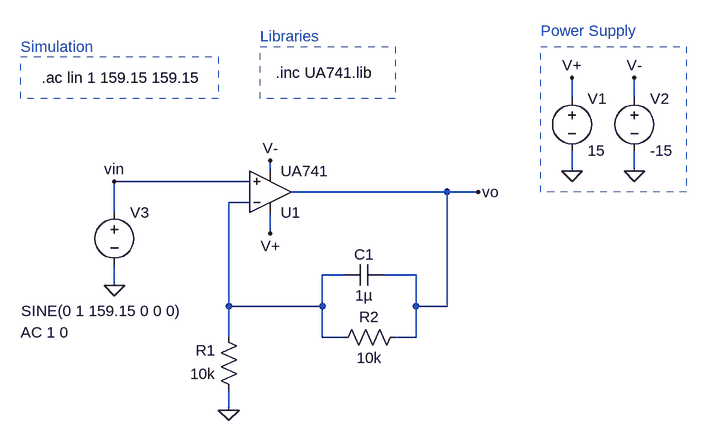
[diagram p0: schematic Example_2.asc]
Example_2.asc, the LTspice schematic file:
Version 4
SHEET 1 1788 680
WIRE 656 -272 656 -304
WIRE 752 -272 752 -304
WIRE 192 -160 192 -176
WIRE 656 -160 656 -192
WIRE 752 -160 752 -192
WIRE 160 -144 -48 -144
WIRE 464 -128 224 -128
WIRE 512 -128 464 -128
WIRE 160 -112 128 -112
WIRE -48 -96 -48 -144
WIRE 192 -64 192 -96
WIRE 304 0 272 0
WIRE 416 0 368 0
WIRE -48 16 -48 -16
WIRE 128 48 128 -112
WIRE 272 48 272 0
WIRE 272 48 128 48
WIRE 416 48 416 0
WIRE 464 48 464 -128
WIRE 464 48 416 48
WIRE 128 96 128 48
WIRE 272 96 272 48
WIRE 304 96 272 96
WIRE 416 96 416 48
WIRE 416 96 384 96
WIRE 128 208 128 176
FLAG 128 208 0
FLAG 752 -160 0
FLAG 656 -160 0
FLAG 656 -304 V+
FLAG 752 -304 V-
FLAG 192 -64 V+
FLAG 192 -176 V-
FLAG 512 -128 vo
FLAG -48 16 0
FLAG -48 -144 vin
SYMBOL res 144 192 R180
WINDOW 0 36 76 Left 2
WINDOW 3 36 40 Left 2
SYMATTR InstName R1
SYMATTR Value 10k
SYMBOL res 288 112 R270
WINDOW 0 32 56 VTop 2
WINDOW 3 0 56 VBottom 2
SYMATTR InstName R2
SYMATTR Value 10k
SYMBOL cap 368 -16 R90
WINDOW 0 0 32 VBottom 2
WINDOW 3 32 32 VTop 2
SYMATTR InstName C1
SYMATTR Value 1µ
SYMBOL OpAmps\\opamp2 192 -64 M180
SYMATTR InstName U1
SYMATTR Value UA741
SYMBOL voltage 656 -288 R0
SYMATTR InstName V1
SYMATTR Value 15
SYMBOL voltage 752 -288 R0
SYMATTR InstName V2
SYMATTR Value -15
SYMBOL voltage -48 -112 R0
WINDOW 3 -143 167 Left 2
WINDOW 123 -144 200 Left 2
WINDOW 39 0 0 Left 0
SYMATTR Value SINE(0 1 159.15 0 0 0)
SYMATTR Value2 AC 1 0
SYMATTR InstName V3
TEXT 200 -312 Left 2 !.inc UA741.lib
TEXT -160 -304 Left 2 !.ac lin 1 159.15 159.15
TEXT 176 -368 Left 2 ;Libraries
TEXT 608 -376 Left 2 ;Power Supply
TEXT -192 -352 Left 2 ;Simulation
RECTANGLE Normal 384 -272 176 -352 2
RECTANGLE Normal 832 -128 608 -352 2
RECTANGLE Normal 112 -272 -192 -336 2

The netlist it stands for:
* Example_2.asc
R1 0 N001 10k
R2 N001 vo 10k
C1 vo N001 1µ
XU1 vin N001 V+ V- vo UA741  ; pins In+ In- V+ V- OUT
V1 V+ 0 15
V2 V- 0 -15
V3 vin 0 SINE(0 1 159.15 0 0 0) AC 1 0
.inc UA741.lib
.ac lin 1 159.15 159.15
* Libraries
* Power Supply
* Simulation
.backanno
.end